# EAGLE schematic EWSII (EAGLE 9.3.1)
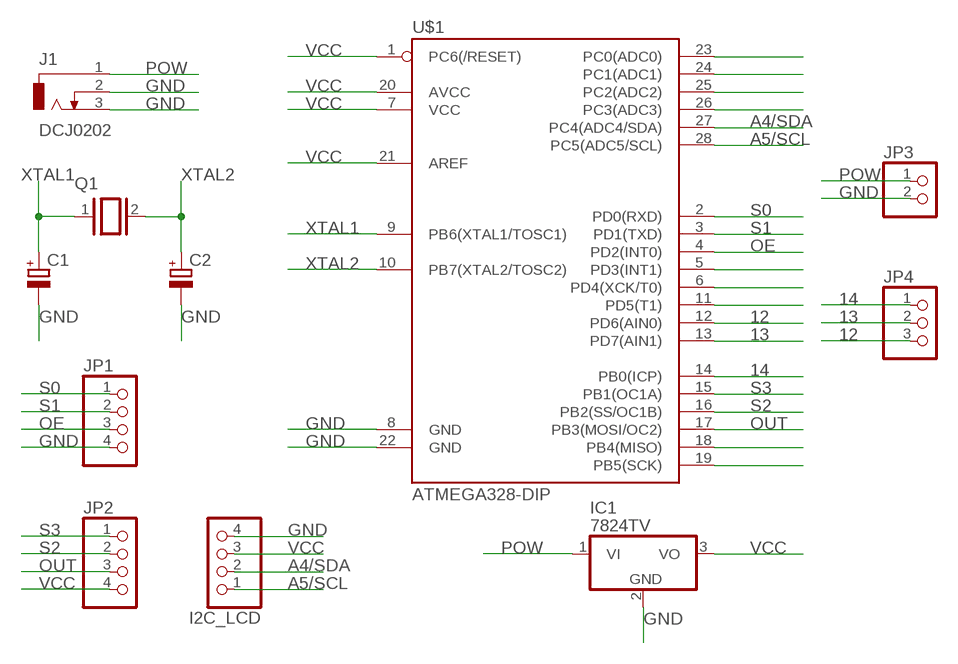
[diagram p0: schematic, sheet 1]

## Parts
C1  CPOL-EUE2-5  [E2-5]
C2  CPOL-EUE2-5  [E2-5]
I2C_LCD  PINHD-1X4  [1X04]
IC1  7824TV  [TO220V]
J1  DCJ0202  [DCJ0202]
JP1  PINHD-1X4  [1X04]
JP2  PINHD-1X4  [1X04]
JP3  PINHD-1X2  [1X02]
JP4  PINHD-1X3  [1X03]
Q1  XTAL/S  [QS]
U$1  ATMEGA328-DIP  [DIP1016W53P254L3466H457Q28B]

## Nets
12: JP4.3 U$1.12(PD6(AIN0))
13: JP4.2 U$1.13(PD7(AIN1))
14: JP4.1 U$1.14(PB0(ICP))
A4/SDA: I2C_LCD.2 U$1.27(PC4(ADC4/SDA))
A5/SCL: I2C_LCD.1 U$1.28(PC5(ADC5/SCL))
GND [power]: C1.- C2.- I2C_LCD.4 IC1.2(GND) J1.2 J1.3 JP1.4 JP3.2 U$1.8(GND) U$1.22(GND)
N$1: U$1.19(PB5(SCK))
N$2: U$1.5(PD3(INT1))
N$5: U$1.11(PD5(T1))
N$9: U$1.18(PB4(MISO))
N$17: U$1.6(PD4(XCK/T0))
N$24: U$1.26(PC3(ADC3))
N$25: U$1.25(PC2(ADC2))
N$26: U$1.24(PC1(ADC1))
N$27: U$1.23(PC0(ADC0))
OE: JP1.3 U$1.4(PD2(INT0))
OUT: JP2.3 U$1.17(PB3(MOSI/OC2))
POW [power]: IC1.1(VI) J1.1 JP3.1
S0: JP1.1 U$1.2(PD0(RXD))
S1: JP1.2 U$1.3(PD1(TXD))
S2: JP2.2 U$1.16(PB2(SS/OC1B))
S3: JP2.1 U$1.15(PB1(OC1A))
VCC [power]: I2C_LCD.3 IC1.3(VO) JP2.4 U$1.1(PC6(/RESET)) U$1.7(VCC) U$1.20(AVCC) U$1.21(AREF)
XTAL1: C1.+ Q1.1 U$1.9(PB6(XTAL1/TOSC1))
XTAL2: C2.+ Q1.2 U$1.10(PB7(XTAL2/TOSC2))

## Library data of the parts
C1 C2 = rcl:CPOL-EU: POLARIZED CAPACITOR, European symbol; SPICEPREFIX: C
I2C_LCD JP1 JP2 = pinhead:PINHD-1X4: PIN HEADER
IC1 = linear:78*: Positive VOLTAGE REGULATOR Source: http://cache.national.com/ds/LM/LM78L05.pdf http://www.fairchildsemi.com/ds/LM/LM7805.pdf
J1 = con-jack:DCJ0202: DC POWER JACK Source: DCJ0202.pdf; OC_FARNELL: unknown; OC_NEWARK: unknown
JP3 = pinhead:PINHD-1X2: PIN HEADER
JP4 = pinhead:PINHD-1X3: PIN HEADER
Q1 = special:XTAL/S: CRYSTAL
U$1 = custom:ATMEGA328-DIP

## Net classes
0 default: width 0.508 mm, drill 0.254 mm, clearance 0.635 mm
1 power: width 0.635 mm, drill 0.254 mm, clearance 0.635 mm